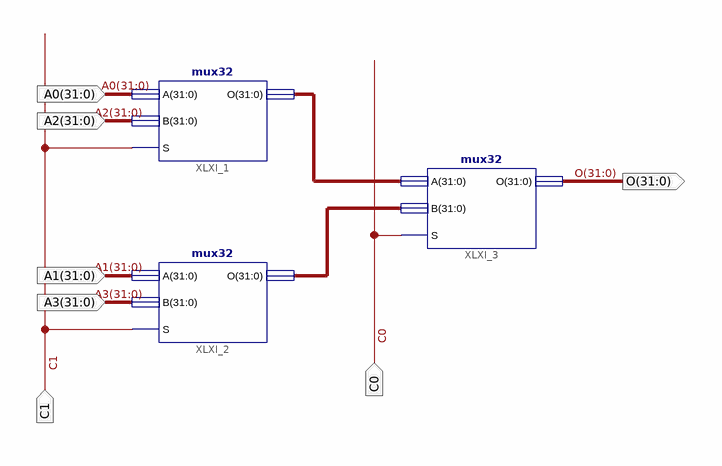
[diagram p0: schematic sheet 1]
// Xilinx ISE schematic mux32_4_1.sch (artix7) as structural Verilog: 3 symbols, 7 ports
module mux32_4_1 (
  input  [31:0] A0,
  input  [31:0] A1,
  input  [31:0] A3,
  input  C0,
  input  C1,
  input  [31:0] A2,
  output [31:0] O
);

  wire [31:0] XLXN_7, XLXN_8;

  mux32 XLXI_1 (.A(A0), .B(A2), .S(C1), .O(XLXN_7));
  mux32 XLXI_2 (.A(A1), .B(A3), .S(C1), .O(XLXN_8));
  mux32 XLXI_3 (.A(XLXN_7), .B(XLXN_8), .S(C0), .O(O));
endmodule
